# Altium project Smartwatch.PrjPcb (part 1 of 2)
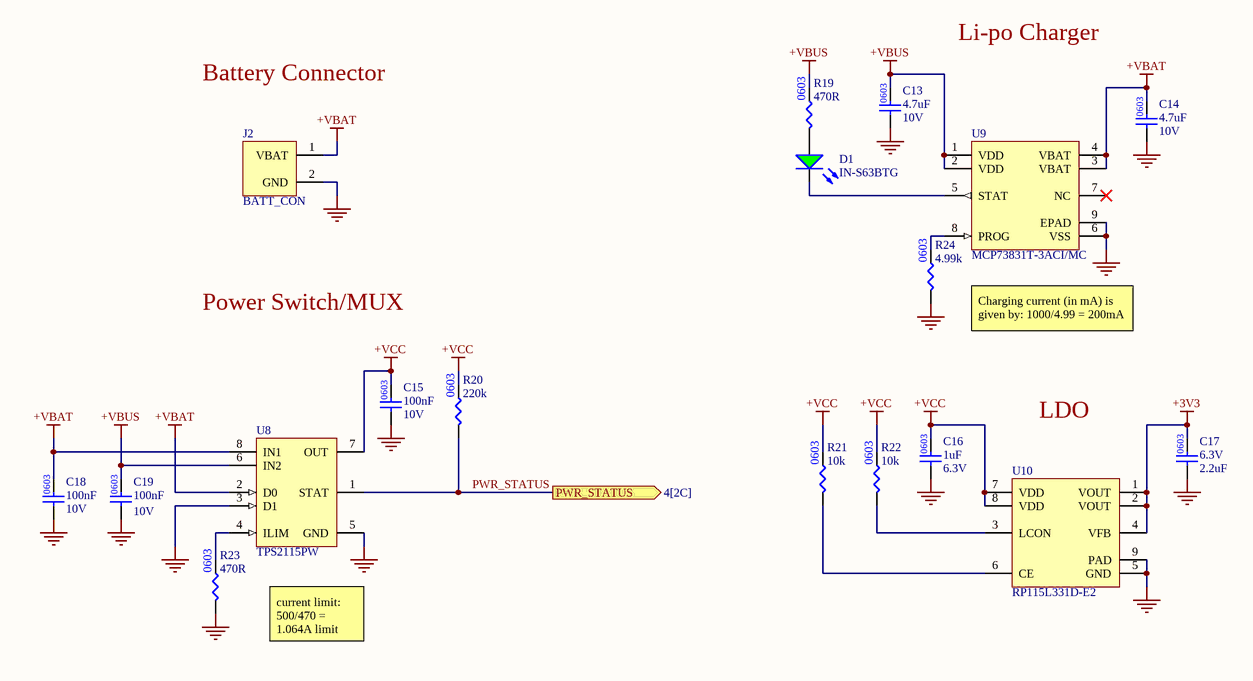
[diagram p0: Board_Power.SchDoc]
Revision: 1; Project_title: Smartwatch
4 sheets, 66 parts. Net scope: flat (ports and power ports of the same name join across sheets).
Board file: Smartwatch.PcbDoc
Sheets:
  Board_Power.SchDoc
  ESP32.SchDoc
  Sensors.SchDoc
  IO_Expander.SchDoc

## Sheet Board_Power.SchDoc: Board Power
size A4; Engineer: Jason Skells; SheetNumber: 1; SheetTotal: 4

### Parts
C13  Capacitance: 4.7uF  Voltage Rating: 10V  [CAP_0603]  (hidden comment: CL10A475KP8NNNC)
C14  Capacitance: 4.7uF  Voltage Rating: 10V  [CAP_0603]  (hidden comment: CL10A475KP8NNNC)
C15  Capacitance: 100nF  Voltage Rating: 10V  [CAP_0603]  (hidden comment: CC0603KRX7R6BB104)
C16  Capacitance: 1uF  Voltage Rating (DC): 6.3V  [CAP_0603]  (hidden comment: CL10A105KQ8NNNC)
C17  Voltage Rating: 6.3V  Capacitance: 2.2uF  [CAP_0603]  (hidden comment: CL10A225KQ8NNNC)
C18  Capacitance: 100nF  Voltage Rating: 10V  [CAP_0603]  (hidden comment: CC0603KRX7R6BB104)
C19  Capacitance: 100nF  Voltage Rating: 10V  [CAP_0603]  (hidden comment: CC0603KRX7R6BB104)
D1  IN-S63BTG  [LED_0603]
J2  BATT_CON  [BATT_CON]
R19  Resistance: 470R  [RES_0603]  (hidden comment: RC0603FR-07470RL)
R20  Resistance: 220k  [RES_0603]  (hidden comment: RMCF0603FT220K)
R21  Resistance: 10k  [RES_0603]  (hidden comment: RNCP0603FTD10K0)
R22  Resistance: 10k  [RES_0603]  (hidden comment: RNCP0603FTD10K0)
R23  Resistance: 470R  [RES_0603]  (hidden comment: RC0603FR-07470RL)
R24  Resistance: 4.99k  [RES_0603]  (hidden comment: RC0603FR-074K99L)
U8  TPS2115PW  [TPS2115PW]
U9  MCP73831T-3ACI/MC  [MCP73831T-3ACI/MC]
U10  RP115L331D-E2  [RP115L331D-E2]

### Ports
PWR_STATUS (out, see 4[2C])

### Nets
+3V3: C17.2 U10.1(VOUT) U10.2(VOUT) U10.4(VFB)
+VBAT: C14.2 C18.2 J2.1(VBAT) U8.2(D0) U8.8(IN1) U9.3(VBAT) U9.4(VBAT)
+VBUS: C13.2 C19.2 R19.2 U8.6(IN2) U9.1(VDD) U9.2(VDD)
+VCC: C15.2 C16.2 R20.2 R21.2 R22.2 U8.7(OUT) U10.7(VDD) U10.8(VDD)
GND: C13.1 C14.1 C15.1 C16.1 C17.1 C18.1 C19.1 J2.2(GND) R23.1 R24.1 U8.3(D1) U8.5(GND) U9.6(VSS) U9.9(EPAD) U10.5(GND) U10.9(PAD)
PWR_STATUS: R20.1 U8.1(STAT) ; port PWR_STATUS
NetD1_1: D1.1(A) R19.1
NetD1_2: D1.2(K) U9.5(STAT)
NetR21_1: R21.1 U10.6(CE)
NetR22_1: R22.1 U10.3(LCON)
NetR23_2: R23.2 U8.4(ILIM)
NetR24_2: R24.2 U9.8(PROG)

Not connected (* = marked no-connect by the designer): U9 7(NC)*

### Notes on the sheet
- Li-po Charger
- Battery Connector
- Power Switch/MUX
- Charging current (in mA) is given by: 1000/4.99 = 200mA
- LDO
- current limit: 500/470 = 1.064A limit

### Library data of the parts
C13 C14 = CL10A475KP8NNNC: CAP CER 4.7UF 10V X5R 0603; Manufacturer: Samsung; Tolerance: 10%; Supplier 1: Digi-Key; Manufacturer Part Number: CL10A475KP8NNNC; RoHS: Yes; Category: Ceramic Capacitors; Stock 1: 5193189; Pricing 1: 1=0.10000, 10=0.04700, 50=0.02580, 100=0.02110, 500=0.01506, 1000=0.01183 (USD); Mount: Surface Mount; Case/Package: 0603; Case Code (Metric): 1608; Case Code (Imperial): 0603; Contact Plating: Tin; Min Operating Temperature: -55°C; Max Operating Temperature: 85°C; Package Quantity: 1; Packaging: Tape and Reel; Dielectric: X5R; Series: CL; Construction: Flat; Length: 1.6mm; Width: 0.031inch; Height: 0.8mm; Thickness: 0.035inch; Depth: 0.8mm; Radiation Hardening: No; RoHS Compliant: Yes; ComponentLink1URL: https://datasheet.ciiva.com/25797/cl10a475kp8nnnc-25797520.pdf?src-supplier=Digi-Key; ComponentLink1Description: https://datasheet.ciiva.com/25797/cl10a475kp8nnnc-25797520.pdf?src-supplier=Digi-Key; ComponentLink2URL: https://datasheet.ciiva.com/26838/getdatasheetpartid-358676-26838384.pdf?src-supplier=Verical; ComponentLink2Description: https://datasheet.ciiva.com/26838/getdatasheetpartid-358676-26838384.pdf?src-supplier=Verical; ComponentLink3URL: https://datasheet.ciiva.com/16318/cl05b104kq5nnnc-16318245.pdf?src-supplier=Future+Electronics; ComponentLink3Description: https://datasheet.ciiva.com/16318/cl05b104kq5nnnc-16318245.pdf?src-supplier=Future+Electronics; Supplier Part Number 1: 1276-1044-1-ND
C15 C18 C19 = CC0603KRX7R6BB104: CAP CER 0.1UF 10V X7R 0603; Manufacturer: Yageo; Tolerance: 10%; Supplier 1: Digi-Key; Manufacturer Part Number: CC0603KRX7R6BB104; RoHS: Yes; Category: Ceramic Capacitors; Stock 1: 135167; Pricing 1: 1=0.11000, 10=0.07700, 50=0.04340, 100=0.03600, 500=0.02522, 1000=0.02089 (USD); Mount: Surface Mount; Case/Package: 0603; Case Code (Imperial): 0603; Case Code (Metric): 1608; Weight: 7.1E-05oz; Min Operating Temperature: -55°C; Max Operating Temperature: 125°C; Dielectric: X7R; Voltage Rating (DC): 10V; Packaging: Tape and Reel; Termination: SMD/SMT; Resistor Type: Ceramic; Series: CC; Construction: Flat; Length: 1.6mm; Width: 0.8mm; Height: 0.8mm; Thickness: 0.035inch; Depth: 0.8mm; Radiation Hardening: No; Lead Free: Lead Free; Halogen Free: Halogen Free; RoHS Compliant: Yes; ComponentLink1URL: https://datasheet.ciiva.com/11586/upy-gphc-x7r-6-3v-to-50v-8-11586327.pdf?src-supplier=Avnet; ComponentLink1Description: https://datasheet.ciiva.com/11586/upy-gphc-x7r-6-3v-to-50v-8-11586327.pdf?src-supplier=Avnet; Supplier Part Number 1: 311-4055-1-ND
C16 = CL10A105KQ8NNNC: CAP CER 1UF 6.3V X5R 0603; Manufacturer: Samsung; Tolerance: 10%; Supplier 1: Digi-Key; Manufacturer Part Number: CL10A105KQ8NNNC; RoHS: Yes; Category: Ceramic Capacitors; Stock 1: 1150582; Pricing 1: 1=0.10000, 10=0.03100, 50=0.01700, 100=0.01390, 500=0.00990, 1000=0.00777 (USD); Mount: Surface Mount; Case/Package: 0603; Case Code (Metric): 1608; Case Code (Imperial): 0603; Min Operating Temperature: -55°C; Max Operating Temperature: 85°C; Dielectric: X5R; Packaging: Tape and Reel; Package Quantity: 1; Voltage Rating: 6.3V; Series: CL; Construction: Flat; Length: 1.6mm; Width: 0.031inch; Height: 0.8mm; Thickness: 0.035inch; Depth: 0.8mm; Radiation Hardening: No; Lead Free: Lead Free; RoHS Compliant: Yes; ComponentLink1URL: https://datasheet.ciiva.com/25801/cl10a105kq8nnnc-25801975.pdf?src-supplier=Digi-Key; ComponentLink1Description: https://datasheet.ciiva.com/25801/cl10a105kq8nnnc-25801975.pdf?src-supplier=Digi-Key; ComponentLink2URL: https://datasheet.ciiva.com/26838/getdatasheetpartid-355285-26838337.pdf?src-supplier=Verical; ComponentLink2Description: https://datasheet.ciiva.com/26838/getdatasheetpartid-355285-26838337.pdf?src-supplier=Verical; ComponentLink3URL: https://datasheet.ciiva.com/16199/cl10a105ko8nnnc-16199274.pdf?src-supplier=Future+Electronics; ComponentLink3Description: https://datasheet.ciiva.com/16199/cl10a105ko8nnnc-16199274.pdf?src-supplier=Future+Electronics; Supplier Part Number 1: 1276-1036-1-ND
C17 = CL10A225KQ8NNNC: CAP CER 2.2UF 6.3V X5R 0603; Manufacturer: Samsung; Tolerance: 10%; Supplier 1: Digi-Key; Manufacturer Part Number: CL10A225KQ8NNNC; RoHS: Yes; Category: Ceramic Capacitors; Stock 1: 697049; Pricing 1: 1=0.10000, 10=0.04200, 50=0.02300, 100=0.01870, 500=0.01336, 1000=0.01050 (USD); Mount: Surface Mount; Case/Package: 0603; Case Code (Metric): 1608; Case Code (Imperial): 0603; Contact Plating: Tin; Min Operating Temperature: -55°C; Max Operating Temperature: 85°C; Packaging: Tape and Reel; Package Quantity: 1; Dielectric: X5R; Voltage Rating (DC): 6.3V; Series: CL; Construction: Flat; Voltage: 6.3V; Length: 1.6mm; Width: 0.031inch; Height: 0.8mm; Thickness: 0.035inch; Depth: 0.8mm; Radiation Hardening: No; Lead Free: Lead Free; RoHS Compliant: Yes; ComponentLink1URL: https://datasheet.ciiva.com/16199/cl10a225kq8nnnc-16199203.pdf?src-supplier=Future+Electronics; ComponentLink1Description: https://datasheet.ciiva.com/16199/cl10a225kq8nnnc-16199203.pdf?src-supplier=Future+Electronics; ComponentLink2URL: https://datasheet.ciiva.com/15195/getdatasheetpartid-358618-15195712.pdf?src-supplier=Verical; ComponentLink2Description: https://datasheet.ciiva.com/15195/getdatasheetpartid-358618-15195712.pdf?src-supplier=Verical; Supplier Part Number 1: 1276-1183-1-ND
D1 = IN-S63BTG: LED Uni-Color Green 530nm 2-Pin Chip 0603(1608Metric) T/R; Manufacturer: Inolux; Supplier 1: Digi-Key; Manufacturer Part Number: IN-S63BTG; RoHS: Yes; Category: LEDs; Stock 1: 10550; Pricing 1: 1=0.33000, 10=0.26300, 100=0.11830, 500=0.10684, 1000=0.08777, 2000=0.07632 (USD); Supplier Part Number 1: 1830-1069-1-ND
J2 = BATT_CON: Pads for Battery Connection
R19 R23 = RC0603FR-07470RL: RES 470 OHM 1% 1/10W 0603; Manufacturer: Yageo; Power Rating: 100mW; Voltage Rating: 50V; Temperature Coefficient: 100ppm/°C; Working Voltage: 75V; Supplier 1: Digi-Key; Manufacturer Part Number: RC0603FR-07470RL; RoHS: Yes; Category: Chip SMD Resistors; Stock 1: 1312688; Pricing 1: 1=0.10000, 10=0.02400, 100=0.00970, 1000=0.00436, 2500=0.00378 (USD); Case/Package: 0603; Case Code (Metric): 1608; Case Code (Imperial): 0603; Min Operating Temperature: -55°C; Max Operating Temperature: 155°C; Tolerance: 1%; Packaging: Tape and Reel; Package Quantity: 1; Resistor Type: Thick Film; Number of Terminations: 2; Termination: SMD/SMT; Max Power Dissipation: 100mW; Features: Moisture Resistant; Series: RC; Technology: THICK FILM; Resistance Tolerance: 1%; Construction: Rectangular; Length: 1.6mm; Width: 0.031inch; Height: 0.022inch; Depth: 0.8mm; RoHS Compliant: Yes; REACH SVHC: No SVHC; Military Standard: Not; Lead Free: Lead Free; ComponentLink1URL: https://datasheet.ciiva.com/11808/0900766b80f96399-11808177.pdf?src-supplier=RSComponents; ComponentLink1Description: https://datasheet.ciiva.com/11808/0900766b80f96399-11808177.pdf?src-supplier=RSComponents; ComponentLink2URL: https://datasheet.ciiva.com/7660/1868787-7660793.pdf?src-supplier=Element14; ComponentLink2Description: https://datasheet.ciiva.com/7660/1868787-7660793.pdf?src-supplier=Element14; ComponentLink3URL: https://datasheet.ciiva.com/46440/1868787-46440907.pdf?src-supplier=Element14; ComponentLink3Description: https://datasheet.ciiva.com/46440/1868787-46440907.pdf?src-supplier=Element14; ComponentLink4URL: https://datasheet.ciiva.com/2454/pyu-r-int-thick-7-2454013.pdf?src-supplier=Digi-Key; ComponentLink4Description: https://datasheet.ciiva.com/2454/pyu-r-int-thick-7-2454013.pdf?src-supplier=Digi-Key; ComponentLink5URL: https://datasheet.ciiva.com/2454/pyu-r-int-thick-7-2454014.pdf?src-supplier=Digi-Key; ComponentLink5Description: https://datasheet.ciiva.com/2454/pyu-r-int-thick-7-2454014.pdf?src-supplier=Digi-Key; ComponentLink6URL: https://datasheet.ciiva.com/2454/pyu-r-int-thick-7-2454012.pdf?src-supplier=Digi-Key; ComponentLink6Description: https://datasheet.ciiva.com/2454/pyu-r-int-thick-7-2454012.pdf?src-supplier=Digi-Key; ComponentLink7URL: https://datasheet.ciiva.com/7746/1738695-7746359.pdf?src-supplier=Element14; ComponentLink7Description: https://datasheet.ciiva.com/7746/1738695-7746359.pdf?src-supplier=Element14; ComponentLink8URL: https://datasheet.ciiva.com/7746/1738695-7746360.pdf?src-supplier=Element14; ComponentLink8Description: https://datasheet.ciiva.com/7746/1738695-7746360.pdf?src-supplier=Element14; Supplier Part Number 1: 311-470HRCT-ND
R20 = RMCF0603FT220K: Res Thick Film 0603 220K Ohm 1% 0.1W(1/10W) ±100ppm/C Pad SMD Automotive T/R; Manufacturer: Stackpole Electronics; Max Power Dissipation: 100mW; Temperature Coefficient: 100ppm/°C; Supplier 1: Digi-Key; Manufacturer Part Number: RMCF0603FT220K; RoHS: Yes; Category: Chip SMD Resistors; Stock 1: 3017881; Pricing 1: 1=0.10000, 10=0.01700, 100=0.00680, 1000=0.00305, 2500=0.00264 (USD); Mount: Surface Mount; Case/Package: 0603; Case Code (Metric): 1608; Case Code (Imperial): 0603; Contact Plating: Tin,Matte; Min Operating Temperature: -55°C; Max Operating Temperature: 155°C; Tolerance: 1%; Packaging: Tape and Reel; Resistor Type: Thick Film; Number of Terminations: 2; Features: Automotive AEC-Q200; Series: RMCF; Construction: Rectangular; Length: 0.061inch; Width: 0.031inch; Height: 0.022inch; Depth: 0.8mm; Radiation Hardening: No; Military Standard: Not; Lead Free: Lead Free; RoHS Compliant: Yes; ComponentLink1URL: https://datasheet.ciiva.com/26835/getdatasheetpartid-479010-26835622.pdf?src-supplier=Verical; ComponentLink1Description: https://datasheet.ciiva.com/26835/getdatasheetpartid-479010-26835622.pdf?src-supplier=Verical; Supplier Part Number 1: RMCF0603FT220KCT-ND
R21 R22 = RNCP0603FTD10K0: Res Thin Film 0603 10K Ohm 1% 1/8W ±100ppm/°C Molded SMD SMD Paper T/R; Manufacturer: Stackpole Electronics; Max Power Dissipation: 125mW; Supplier 1: Digi-Key; Manufacturer Part Number: RNCP0603FTD10K0; RoHS: Yes; Category: Chip SMD Resistors; Stock 1: 2737524; Pricing 1: 1=0.10000, 10=0.06100, 100=0.02480, 1000=0.01113, 2500=0.00966 (USD); Mount: Surface Mount; Case/Package: 0603; Case Code (Metric): 1608; Case Code (Imperial): 0603; Contact Plating: Tin,Matte; Min Operating Temperature: -55°C; Max Operating Temperature: 155°C; Packaging: Tape and Reel; Tolerance: 1%; Resistor Type: Thin Film; Number of Terminations: 2; Temperature Coefficient: 100ppm/°C; Features: Moisture Resistant,Anti-Sulfur; Series: RNCP; Length: 0.059inch; Width: 0.031inch; Height: 0.02inch; Radiation Hardening: No; Lead Free: Lead Free; RoHS Compliant: Yes; ComponentLink1URL: https://www.seielect.com/Catalog/SEI-rncp.pdf?src-supplier=Avnet; ComponentLink1Description: https://www.seielect.com/Catalog/SEI-rncp.pdf?src-supplier=Avnet; ComponentLink2URL: https://www.seielect.com/Catalog/SEI-rncp.pdf?src-supplier=Digi-Key; ComponentLink2Description: https://www.seielect.com/Catalog/SEI-rncp.pdf?src-supplier=Digi-Key; ComponentLink3URL: https://www.seielect.com/catalog/SEI-Packaging.pdf?src-supplier=Digi-Key; ComponentLink3Description: https://www.seielect.com/catalog/SEI-Packaging.pdf?src-supplier=Digi-Key; Supplier Part Number 1: RNCP0603FTD10K0CT-ND
R24 = RC0603FR-074K99L: RES 4.99K OHM 1% 1/10W 0603; Manufacturer: Yageo; Voltage Rating: 75V; Power Rating: 100mW; Temperature Coefficient: 100ppm/°C; Voltage Rating (DC): 50V; Supplier 1: Digi-Key; Manufacturer Part Number: RC0603FR-074K99L; RoHS: Yes; Category: Chip SMD Resistors; Stock 1: 5200913; Pricing 1: 1=0.10000, 10=0.02400, 100=0.00970, 1000=0.00436, 2500=0.00378 (USD); Case/Package: 0603; Number of Pins: 2; Case Code (Imperial): 0603; Case Code (Metric): 1608; Weight: 7.1E-05oz; Size Code: 0603; Min Operating Temperature: -55°C; Max Operating Temperature: 155°C; Packaging: Tape and Reel; Tolerance: 1%; Package Quantity: 1; Termination: SMD/SMT; Resistor Type: Thick Film; Number of Terminations: 2; Max Power Dissipation: 100mW; Features: Moisture Resistant; Series: RC; Construction: Rectangular; Resistance Tolerance: 1%; Length: 1.6mm; Width: 0.8mm; Height: 0.022inch; Depth: 0.8mm; REACH SVHC: Unknown; Military Standard: Not; Lead Free: Lead Free; RoHS Compliant: Yes; ComponentLink1URL: https://datasheet.ciiva.com/7983/443971-7983646.pdf?src-supplier=Element14; ComponentLink1Description: https://datasheet.ciiva.com/7983/443971-7983646.pdf?src-supplier=Element14; ComponentLink2URL: https://datasheet.ciiva.com/22747/443971-22747529.pdf?src-supplier=Element14; ComponentLink2Description: https://datasheet.ciiva.com/22747/443971-22747529.pdf?src-supplier=Element14; ComponentLink3URL: https://datasheet.ciiva.com/2453/pyu-r-int-thick-7-2453980.pdf?src-supplier=Digi-Key; ComponentLink3Description: https://datasheet.ciiva.com/2453/pyu-r-int-thick-7-2453980.pdf?src-supplier=Digi-Key; ComponentLink4URL: https://datasheet.ciiva.com/2453/pyu-r-int-thick-7-2453981.pdf?src-supplier=Digi-Key; ComponentLink4Description: https://datasheet.ciiva.com/2453/pyu-r-int-thick-7-2453981.pdf?src-supplier=Digi-Key; ComponentLink5URL: https://datasheet.ciiva.com/2453/pyu-r-int-thick-7-2453979.pdf?src-supplier=Digi-Key; ComponentLink5Description: https://datasheet.ciiva.com/2453/pyu-r-int-thick-7-2453979.pdf?src-supplier=Digi-Key; Supplier Part Number 1: 311-4.99KHRCT-ND
U8 = TPS2115PW: Pwr Mux Autoswitch 1.5V to 5.5V 1.25A 8-Pin TSSOP Tube; Manufacturer: Texas Instruments; Number of Outputs: 1; Number of Inputs: 2; Min Input Voltage: 2.8V; Turn-On Delay Time: 1ms; Max Power Dissipation: 386.84mW; On-State Resistance: 84mR; Max Supply Current: 55uA; Output Voltage: 6V; Supplier 1: Digi-Key; Manufacturer Part Number: TPS2115PW; RoHS: Yes; Category: Voltage Regulators - Switching; Stock 1: 1098; Pricing 1: 1=2.94000, 10=2.63600, 25=2.49240, 100=2.16000, 250=2.04924, 500=1.83878, 1000=1.82875 (USD); Case/Package: TSSOP; Number of Pins: 8; Weight: 0.001376oz; Min Operating Temperature: -40°C; Max Operating Temperature: 85°C; Output Current: 1.25A; Packaging: Rail/Tube; Package Quantity: 150; Max Output Current: 1.25A; Max Input Voltage: 5.5V; Current - Output 2: 1.25A; Operating Supply Voltage: 5.5V; Series: -; Length: 3mm; Width: 4.4mm; Height: 1.15mm; Radiation Hardening: No; Lead Free: Lead Free; RoHS Compliant: Yes; REACH SVHC: No SVHC; ComponentLink1URL: https://datasheet.ciiva.com/1960/tps2114-1960868.pdf?src-supplier=Digi-Key; ComponentLink1Description: https://datasheet.ciiva.com/1960/tps2114-1960868.pdf?src-supplier=Digi-Key; ComponentLink2URL: https://datasheet.ciiva.com/4923/slvs447a-206199-4923489.pdf?src-supplier=Mouser; ComponentLink2Description: https://datasheet.ciiva.com/4923/slvs447a-206199-4923489.pdf?src-supplier=Mouser; ComponentLink3URL: https://datasheet.ciiva.com/3232/tps2115-3232474.pdf?src-supplier=Avnet; ComponentLink3Description: https://datasheet.ciiva.com/3232/tps2115-3232474.pdf?src-supplier=Avnet; Supplier Part Number 1: 296-14207-5-ND
U9 = MCP73831T-3ACI/MC: Battery Management - Advanced Lithium-Ion/-Polymer Charge mgnt contr; Manufacturer: Microchip; Output Voltage: 4.35V; Output Current: 500mA; Min Supply Voltage: 3.75V; Max Supply Voltage: 6V; Supplier 1: Digi-Key; Manufacturer Part Number: MCP73831T-3ACI/MC; RoHS: Yes; Category: Battery Management; Stock 1: 1670; Pricing 1: 1=0.83000, 25=0.69960, 100=0.64500 (USD); Mount: Surface Mount; Case/Package: DFN; Number of Pins: 8; Min Operating Temperature: -40°C; Max Operating Temperature: 85°C; Packaging: Tape and Reel; Package Quantity: 3300; Radiation Hardening: No; Lead Free: Lead Free; RoHS Compliant: Yes; ComponentLink1URL: https://datasheet.ciiva.com/3215/21984e-3215301.pdf?src-supplier=Avnet; ComponentLink1Description: https://datasheet.ciiva.com/3215/21984e-3215301.pdf?src-supplier=Avnet; ComponentLink2URL: https://datasheet.ciiva.com/1933/21984e-1933408.pdf?src-supplier=Digi-Key; ComponentLink2Description: https://datasheet.ciiva.com/1933/21984e-1933408.pdf?src-supplier=Digi-Key; Supplier Part Number 1: MCP73831T-3ACI/MCCT-ND
U10 = RP115L331D-E2: LDO Regulator Pos 3.3V 0.5A/1A 8-Pin DFN EP T/R; Manufacturer: Ricoh; Supplier 1: Digi-Key; Manufacturer Part Number: RP115L331D-E2; RoHS: No; Category: Voltage Regulators - Linear; Supplier Part Number 1: 2129-RP115L331D-E2CT-ND

## Sheet ESP32.SchDoc: MCU & Display
size A4; Engineer: Jason Skells; SheetNumber: 2; SheetTotal: 4
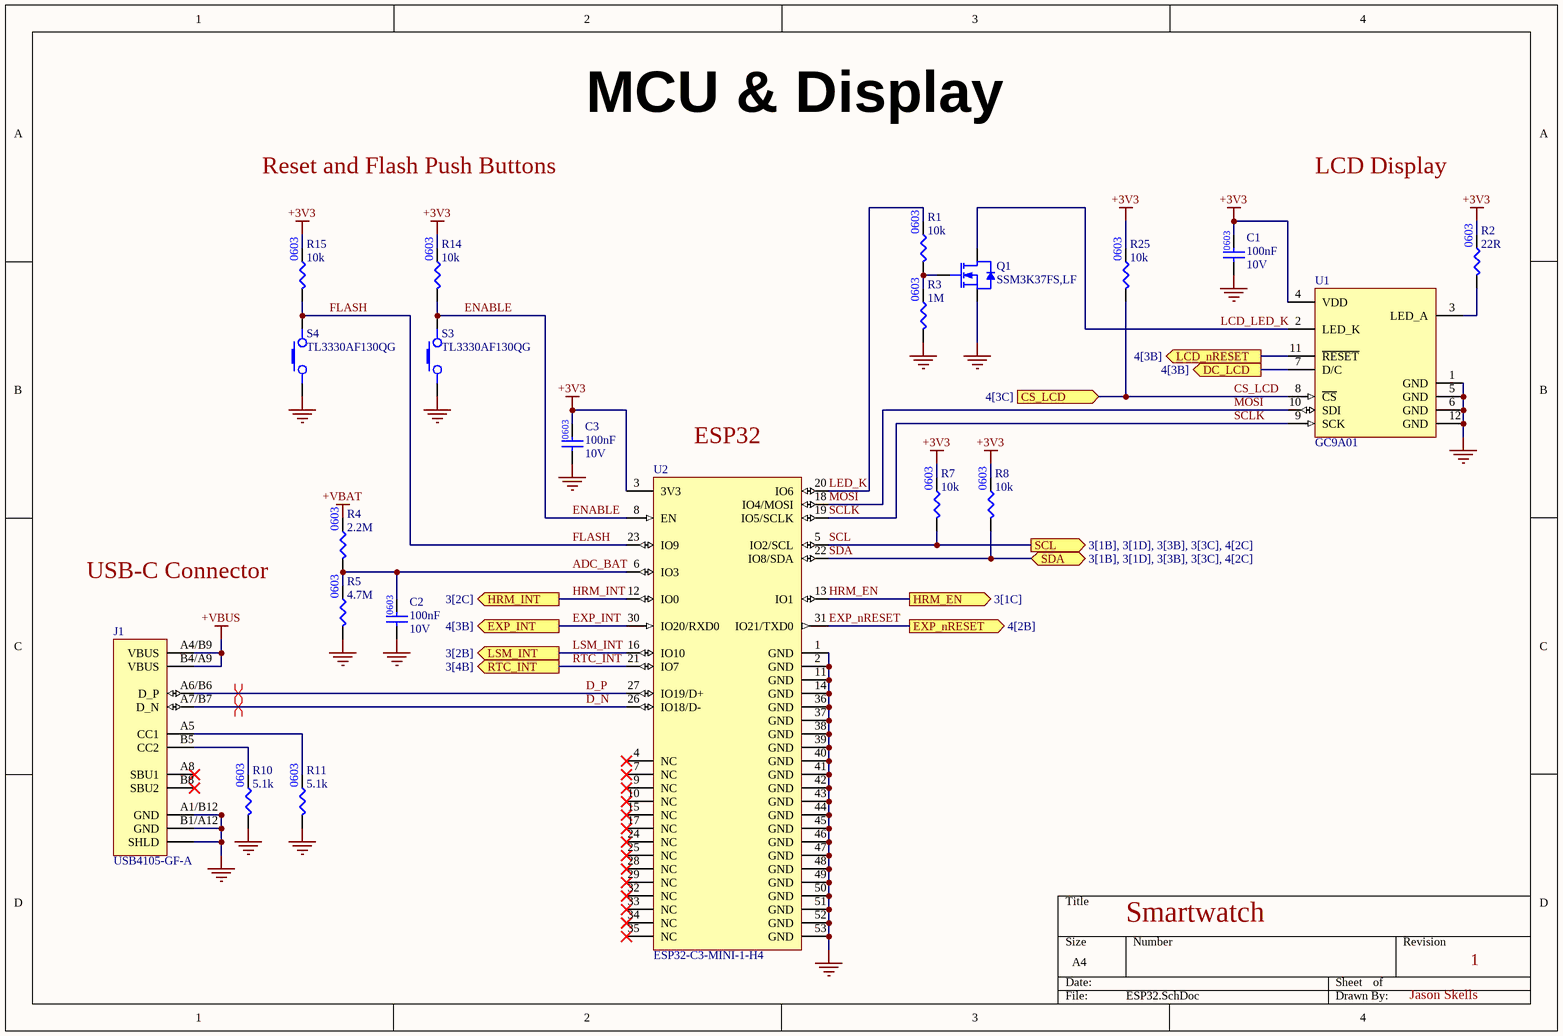
[diagram p1: ESP32.SchDoc]

### Parts
C1  Capacitance: 100nF  Voltage Rating: 10V  [CAP_0603]  (hidden comment: CC0603KRX7R6BB104)
C2  Capacitance: 100nF  Voltage Rating: 10V  [CAP_0603]  (hidden comment: CC0603KRX7R6BB104)
C3  Capacitance: 100nF  Voltage Rating: 10V  [CAP_0603]  (hidden comment: CC0603KRX7R6BB104)
J1  USB4105-GF-A  [USB4105-GF-A]
Q1  SSM3K37FS,LF  [SSM3K37FS,LF]
R1  Resistance: 10k  [RES_0603]  (hidden comment: RNCP0603FTD10K0)
R2  Resistance: 22R  [RES_0603]  (hidden comment: RC0603FR-0722RL)
R3  Resistance: 1M  [RES_0603]  (hidden comment: RC0603FR-071ML)
R4  Resistance: 2.2M  [RES_0603]  (hidden comment: RC0603FR-072M2L)
R5  Resistance: 4.7M  [RES_0603]  (hidden comment: RC0603FR-074M7L)
R7  Resistance: 10k  [RES_0603]  (hidden comment: RNCP0603FTD10K0)
R8  Resistance: 10k  [RES_0603]  (hidden comment: RNCP0603FTD10K0)
R10  Resistance: 5.1k  [RES_0603]  (hidden comment: RMCF0603FT5K10)
R11  Resistance: 5.1k  [RES_0603]  (hidden comment: RMCF0603FT5K10)
R14  Resistance: 10k  [RES_0603]  (hidden comment: RNCP0603FTD10K0)
R15  Resistance: 10k  [RES_0603]  (hidden comment: RNCP0603FTD10K0)
R25  Resistance: 10k  [RES_0603]  (hidden comment: RNCP0603FTD10K0)
S3  TL3330AF130QG  [TL3330AF130QG]
S4  TL3330AF130QG  [TL3330AF130QG]
U1  GC9A01  [GC9A01]
U2  ESP32-C3-MINI-1-H4  [ESP32-C3-MINI-1-H4]

### Ports
CS_LCD (in, see 4[3C]), DC_LCD (out, see 4[3B]), EXP_INT (out, see 4[3B]), EXP_nRESET (out, see 4[2B]), HRM_EN (out, see 3[1C]), HRM_INT (out, see 3[2C]), LCD_nRESET (out, see 4[3B]), LSM_INT (out, see 3[2B]), RTC_INT (out, see 3[4B]), SCL (out, see 3[1B], 3[1D], 3[3B], 3[3C], 4[2C]), SDA (bidir, see 3[1B], 3[1D], 3[3B], 3[3C], 4[2C])

### Nets
+3V3: C1.2 C3.2 R2.2 R7.2 R8.2 R14.2 R15.2 R25.2 U1.4(VDD) U2.3(3V3)
+VBAT: R4.2
+VBUS: J1.A4/B9(VBUS) J1.B4/A9(VBUS)
GND: C1.1 C2.1 C3.1 J1.A1/B12(GND) J1.B1/A12(GND) J1.SHLD Q1.3(Source) R3.1 R5.1 R10.1 R11.1 S3.2 S4.2 U1.1(GND) U1.5(GND) U1.6(GND) U1.12(GND) U2.1(GND) U2.2(GND) U2.11(GND) U2.14(GND) U2.36(GND) U2.37(GND) U2.38(GND) U2.39(GND) U2.40(GND) U2.41(GND) U2.42(GND) U2.43(GND) U2.44(GND) U2.45(GND) U2.46(GND) U2.47(GND) U2.48(GND) U2.49(GND) U2.50(GND) U2.51(GND) U2.52(GND) U2.53(GND)
ADC_BAT: C2.2 R4.1 R5.2 U2.6(IO3)
CS_LCD: R25.1 U1.8(~{CS}) ; port CS_LCD
D_N: J1.A7/B7(D_N) U2.26(IO18/D-)
D_P: J1.A6/B6(D_P) U2.27(IO19/D+)
DC_LCD: U1.7(D/C) ; port DC_LCD
ENABLE: R14.1 S3.1 U2.8(EN)
EXP_INT: U2.30(IO20/RXD0) ; port EXP_INT
EXP_nRESET: U2.31(IO21/TXD0) ; port EXP_nRESET
FLASH: R15.1 S4.1 U2.23(IO9)
HRM_EN: U2.13(IO1) ; port HRM_EN
HRM_INT: U2.12(IO0) ; port HRM_INT
LCD_LED_K: Q1.1(Drain) U1.2(LED_K)
LCD_nRESET: U1.11(~{RESET}) ; port LCD_nRESET
LED_K: R1.2 U2.20(IO6)
LSM_INT: U2.16(IO10) ; port LSM_INT
MOSI: U1.10(SDI) U2.18(IO4/MOSI)
RTC_INT: U2.21(IO7) ; port RTC_INT
SCL: R7.1 U2.5(IO2/SCL) ; port SCL
SCLK: U1.9(SCK) U2.19(IO5/SCLK)
SDA: R8.1 U2.22(IO8/SDA) ; port SDA
NetJ1_A5: J1.A5(CC1) R11.2
NetJ1_B5: J1.B5(CC2) R10.2
NetQ1_2: Q1.2(Gate) R1.1 R3.2
NetR2_1: R2.1 U1.3(LED_A)

Not connected (* = marked no-connect by the designer): J1 A8(SBU1)* B8(SBU2)*; U2 4(NC)* 7(NC)* 9(NC)* 10(NC)* 15(NC)* 17(NC)* 24(NC)* 25(NC)* 28(NC)* 29(NC)* 32(NC)* 33(NC)* 34(NC)* 35(NC)*

### Layout directives
differential pair: D_N, D_P

### Notes on the sheet
- Reset and Flash Push Buttons
- LCD Display
- (near U2) ESP32
- USB-C Connector

### Library data of the parts
C1-C3 = CC0603KRX7R6BB104: as C15 on sheet Board_Power; Supplier 1: Digi-Key; Manufacturer Part Number: CC0603KRX7R6BB104; RoHS: Yes; Category: Ceramic Capacitors; Stock 1: 135167; Pricing 1: 1=0.11000, 10=0.07700, 50=0.04340, 100=0.03600, 500=0.02522, 1000=0.02089 (USD); Mount: Surface Mount; Case/Package: 0603; Case Code (Imperial): 0603; Case Code (Metric): 1608; Weight: 7.1E-05oz; Min Operating Temperature: -55°C; Max Operating Temperature: 125°C; Dielectric: X7R; Voltage Rating (DC): 10V; Packaging: Tape and Reel; Termination: SMD/SMT; Resistor Type: Ceramic; Series: CC; Construction: Flat; Length: 1.6mm; Width: 0.8mm; Height: 0.8mm; Thickness: 0.035inch; Depth: 0.8mm; Radiation Hardening: No; Lead Free: Lead Free; Halogen Free: Halogen Free; RoHS Compliant: Yes; ComponentLink1URL: https://datasheet.ciiva.com/11586/upy-gphc-x7r-6-3v-to-50v-8-11586327.pdf?src-supplier=Avnet; ComponentLink1Description: https://datasheet.ciiva.com/11586/upy-gphc-x7r-6-3v-to-50v-8-11586327.pdf?src-supplier=Avnet; Supplier Part Number 1: 311-4055-1-ND
J1 = USB4105-GF-A: Conn USB 2.0 Type C RCP 24 POS 0.3mm/0.5mm Solder RA SMD 24 Terminal 1 Port T/R; Manufacturer: Global Connector Technology; Supplier 1: Digi-Key; Manufacturer Part Number: USB4105-GF-A; RoHS: No; Category: USB Connectors; Supplier Part Number 1: 2073-USB4105-GF-ACT-ND
Q1 = SSM3K37FS,LF: MOSFET NCH 20V 200MA SSM; Manufacturer: Toshiba; Rds On Max: 2.2R; Input Capacitance: 12pF; Max Power Dissipation: 100mW; Supplier 1: Digi-Key; RoHS: Yes; Category: MOSFETs; Stock 1: 73760; Pricing 1: 1=0.25000, 10=0.20100, 100=0.10660, 500=0.07012, 1000=0.04768 (USD); Mount: Surface Mount; Packaging: Tape and Reel; Drain to Source Voltage (Vdss): 20V; Continuous Drain Current (ID): 200mA; ComponentLink1URL: https://toshiba.semicon-storage.com/info/docget.jsp?did=6172&prodName=SSM3K37FS&src-supplier=Digi-Key; ComponentLink1Description: https://toshiba.semicon-storage.com/info/docget.jsp?did=6172&prodName=SSM3K37FS&src-supplier=Digi-Key; Supplier Part Number 1: SSM3K37FSLFCT-ND; Manufacturer Part Number: SSM3K37FS,LF
R1 R7 R8 R14 R15 R25 = RNCP0603FTD10K0: as R21 on sheet Board_Power; Supplier 1: Digi-Key; Manufacturer Part Number: RNCP0603FTD10K0; RoHS: Yes; Category: Chip SMD Resistors; Stock 1: 2737524; Pricing 1: 1=0.10000, 10=0.06100, 100=0.02480, 1000=0.01113, 2500=0.00966 (USD); Mount: Surface Mount; Case/Package: 0603; Case Code (Metric): 1608; Case Code (Imperial): 0603; Contact Plating: Tin,Matte; Min Operating Temperature: -55°C; Max Operating Temperature: 155°C; Packaging: Tape and Reel; Tolerance: 1%; Resistor Type: Thin Film; Number of Terminations: 2; Temperature Coefficient: 100ppm/°C; Features: Moisture Resistant,Anti-Sulfur; Series: RNCP; Length: 0.059inch; Width: 0.031inch; Height: 0.02inch; Radiation Hardening: No; Lead Free: Lead Free; RoHS Compliant: Yes; ComponentLink1URL: https://www.seielect.com/Catalog/SEI-rncp.pdf?src-supplier=Avnet; ComponentLink1Description: https://www.seielect.com/Catalog/SEI-rncp.pdf?src-supplier=Avnet; ComponentLink2URL: https://www.seielect.com/Catalog/SEI-rncp.pdf?src-supplier=Digi-Key; ComponentLink2Description: https://www.seielect.com/Catalog/SEI-rncp.pdf?src-supplier=Digi-Key; ComponentLink3URL: https://www.seielect.com/catalog/SEI-Packaging.pdf?src-supplier=Digi-Key; ComponentLink3Description: https://www.seielect.com/catalog/SEI-Packaging.pdf?src-supplier=Digi-Key; Supplier Part Number 1: RNCP0603FTD10K0CT-ND
R2 = RC0603FR-0722RL: RES 22 OHM 1% 1/10W 0603; Manufacturer: Yageo; Temperature Coefficient: 100ppm/°C; Voltage Rating (DC): 50V; Power Rating: 100mW; Supplier 1: RSComponents; Manufacturer Part Number: RC0603FR-0722RL; RoHS: Yes; Category: Chip SMD Resistors; Stock 1: 10000; Pricing 1: 5000=0.00300, 10000=0.00300, 15000=0.00300, 20000=0.00300 (GBP); Case/Package: 0603; Number of Pins: 2; Case Code (Metric): 1608; Case Code (Imperial): 0603; Size Code: 0603; Min Operating Temperature: -55°C; Max Operating Temperature: 155°C; Tolerance: 1%; Resistor Type: Thick Film; Packaging: Tape and Reel; Voltage Rating: 50V; Package Quantity: 1; Number of Terminations: 2; Termination: SMD/SMT; Max Power Dissipation: 100mW; Features: Moisture Resistant; Series: RC; Resistance Tolerance: 1%; Technology: THICK FILM; Construction: Rectangular; Length: 1.6mm; Width: 0.031inch; Height: 0.022inch; Depth: 0.8mm; REACH SVHC: No SVHC; Lead Free: Lead Free; Military Standard: Not; RoHS Compliant: Yes; ComponentLink1URL: https://datasheet.ciiva.com/11819/0900766b80f96399-11819285.pdf?src-supplier=RSComponents; ComponentLink1Description: https://datasheet.ciiva.com/11819/0900766b80f96399-11819285.pdf?src-supplier=RSComponents; ComponentLink2URL: https://datasheet.ciiva.com/46395/443971-46395032.pdf?src-supplier=Element14; ComponentLink2Description: https://datasheet.ciiva.com/46395/443971-46395032.pdf?src-supplier=Element14; ComponentLink3URL: https://datasheet.ciiva.com/46440/1868787-46440901.pdf?src-supplier=Element14; ComponentLink3Description: https://datasheet.ciiva.com/46440/1868787-46440901.pdf?src-supplier=Element14; ComponentLink4URL: https://datasheet.ciiva.com/2454/pyu-r-int-thick-7-2454355.pdf?src-supplier=Digi-Key; ComponentLink4Description: https://datasheet.ciiva.com/2454/pyu-r-int-thick-7-2454355.pdf?src-supplier=Digi-Key; ComponentLink5URL: https://datasheet.ciiva.com/2454/pyu-r-int-thick-7-2454356.pdf?src-supplier=Digi-Key; ComponentLink5Description: https://datasheet.ciiva.com/2454/pyu-r-int-thick-7-2454356.pdf?src-supplier=Digi-Key; ComponentLink6URL: https://datasheet.ciiva.com/2454/pyu-r-int-thick-7-2454354.pdf?src-supplier=Digi-Key; ComponentLink6Description: https://datasheet.ciiva.com/2454/pyu-r-int-thick-7-2454354.pdf?src-supplier=Digi-Key; Supplier Part Number 1: 1995503
R3 = RC0603FR-071ML: RES 1M OHM 1% 1/10W 0603; Manufacturer: Yageo; Voltage Rating: 75V; Voltage Rating (DC): 50V; Power Rating: 100mW; Temperature Coefficient: 100ppm/°C; Application(s): HIGH RELIABILITY; Supplier 1: Digi-Key; Manufacturer Part Number: RC0603FR-071ML; RoHS: Yes; Category: Chip SMD Resistors; Stock 1: 2335859; Pricing 1: 1=0.10000, 10=0.02400, 100=0.00970, 1000=0.00436, 2500=0.00378 (USD); Case/Package: 0603; Number of Pins: 2; Case Code (Imperial): 0603; Case Code (Metric): 1608; Weight: 0.000847oz; Min Operating Temperature: -55°C; Max Operating Temperature: 155°C; Tolerance: 1%; Packaging: Cut Tape; Package Quantity: 5000; Termination: SMD/SMT; Resistor Type: Thick Film; Type: General Purpose; Series: RC; Technology: THICK FILM; Length: 1.6mm; Width: 0.8mm; Height: 0.45mm; Depth: 0.8mm; RoHS Compliant: Yes; REACH SVHC: No SVHC; Military Standard: Not; Lead Free: Lead Free; ComponentLink1URL: https://datasheet.ciiva.com/11819/0900766b80f96399-11819295.pdf?src-supplier=RSComponents; ComponentLink1Description: https://datasheet.ciiva.com/11819/0900766b80f96399-11819295.pdf?src-supplier=RSComponents; ComponentLink2URL: https://datasheet.ciiva.com/7983/443971-7983614.pdf?src-supplier=Element14; ComponentLink2Description: https://datasheet.ciiva.com/7983/443971-7983614.pdf?src-supplier=Element14; ComponentLink3URL: https://datasheet.ciiva.com/12555/rc0603-272842-12555388.pdf?src-supplier=Mouser; ComponentLink3Description: https://datasheet.ciiva.com/12555/rc0603-272842-12555388.pdf?src-supplier=Mouser; Supplier Part Number 1: 311-1.00MHRCT-ND
R4 = RC0603FR-072M2L: RES SMD 2.2M OHM 1% 1/10W 0603; Manufacturer: Yageo; Voltage Rating (DC): 50V; Power Rating: 100mW; Temperature Coefficient: 100ppm/°C; Supplier 1: Digi-Key; Manufacturer Part Number: RC0603FR-072M2L; RoHS: Yes; Category: Chip SMD Resistors; Stock 1: 189008; Pricing 1: 1=0.10000, 10=0.02400, 100=0.00970, 1000=0.00436, 2500=0.00378 (USD); Case/Package: 0603; Number of Pins: 2; Case Code (Imperial): 0603; Case Code (Metric): 1608; Size Code: 0603; Min Operating Temperature: -55°C; Max Operating Temperature: 155°C; Packaging: Tape and Reel; Tolerance: 1%; Voltage Rating: 50V; Package Quantity: 5000; Resistor Type: Thick Film; Number of Terminations: 2; Termination: SMD/SMT; Max Power Dissipation: 100mW; Features: Moisture Resistant; Series: RC; Resistance Tolerance: 1%; Technology: THICK FILM; Length: 1.6mm; Width: 0.8mm; Height: 0.45mm; Depth: 0.8mm; REACH SVHC: No SVHC; Lead Free: Lead Free; RoHS Compliant: Yes; ComponentLink1URL: https://datasheet.ciiva.com/11808/0900766b80f96399-11808742.pdf?src-supplier=RSComponents; ComponentLink1Description: https://datasheet.ciiva.com/11808/0900766b80f96399-11808742.pdf?src-supplier=RSComponents; ComponentLink2URL: https://datasheet.ciiva.com/46440/1868787-46440903.pdf?src-supplier=Element14; ComponentLink2Description: https://datasheet.ciiva.com/46440/1868787-46440903.pdf?src-supplier=Element14; ComponentLink3URL: https://datasheet.ciiva.com/12558/rc0603-272842-12558598.pdf?src-supplier=Mouser; ComponentLink3Description: https://datasheet.ciiva.com/12558/rc0603-272842-12558598.pdf?src-supplier=Mouser; ComponentLink4URL: https://datasheet.ciiva.com/7746/443971-7746319.pdf?src-supplier=Element14; ComponentLink4Description: https://datasheet.ciiva.com/7746/443971-7746319.pdf?src-supplier=Element14; Supplier Part Number 1: YAG3329CT-ND
R5 = RC0603FR-074M7L: RES 4.7M OHM 1% 1/10W 0603; Manufacturer: Yageo; Temperature Coefficient: 100ppm/°C; Power Rating: 100mW; Voltage Rating: 50V; Supplier 1: Digi-Key; Manufacturer Part Number: RC0603FR-074M7L; RoHS: Yes; Category: Chip SMD Resistors; Stock 1: 424983; Pricing 1: 1=0.10000, 10=0.02400, 100=0.00970, 1000=0.00436, 2500=0.00378 (USD); Case/Package: 0603; Number of Pins: 2; Case Code (Imperial): 0603; Case Code (Metric): 1608; Size Code: 0603; Min Operating Temperature: -55°C; Max Operating Temperature: 155°C; Tolerance: 1%; Packaging: Tape and Reel; Voltage Rating (DC): 50V; Termination: SMD/SMT; Resistor Type: Thick Film; Features: Moisture Resistant; Series: RC; Max Power Dissipation: 100mW; Number of Terminations: 2; Resistance Tolerance: 1%; Technology: THICK FILM; Construction: Rectangular; Length: 1.6mm; Width: 0.8mm; Height: 0.45mm; Depth: 0.8mm; RoHS Compliant: Yes; REACH SVHC: No SVHC; Military Standard: Not; Lead Free: Lead Free; ComponentLink1URL: https://datasheet.ciiva.com/11819/0900766b80f96399-11819362.pdf?src-supplier=RSComponents; ComponentLink1Description: https://datasheet.ciiva.com/11819/0900766b80f96399-11819362.pdf?src-supplier=RSComponents; ComponentLink2URL: https://datasheet.ciiva.com/7746/443971-7746367.pdf?src-supplier=Element14; ComponentLink2Description: https://datasheet.ciiva.com/7746/443971-7746367.pdf?src-supplier=Element14; ComponentLink3URL: https://datasheet.ciiva.com/15189/getdatasheetpartid-328863-15189765.pdf?src-supplier=Verical; ComponentLink3Description: https://datasheet.ciiva.com/15189/getdatasheetpartid-328863-15189765.pdf?src-supplier=Verical; Supplier Part Number 1: 311-4.70MHRCT-ND
R10 R11 = RMCF0603FT5K10: Res Thick Film 0603 5.1K Ohm 1% 0.1W(1/10W) ±100ppm/C Pad SMD Automotive T/R; Manufacturer: Stackpole Electronics; Max Power Dissipation: 100mW; Temperature Coefficient: 100ppm/°C; Supplier 1: Digi-Key; Manufacturer Part Number: RMCF0603FT5K10; RoHS: Yes; Category: Chip SMD Resistors; Stock 1: 1237364; Pricing 1: 1=0.10000, 10=0.01700, 100=0.00680, 1000=0.00305, 2500=0.00264 (USD); Mount: Surface Mount; Case/Package: 0603; Case Code (Metric): 1608; Case Code (Imperial): 0603; Contact Plating: Tin,Matte; Min Operating Temperature: -55°C; Max Operating Temperature: 155°C; Tolerance: 1%; Packaging: Tape and Reel; Resistor Type: Thick Film; Number of Terminations: 2; Features: Automotive AEC-Q200; Series: RMCF; Length: 0.061inch; Width: 0.031inch; Height: 0.022inch; Radiation Hardening: No; RoHS Compliant: Yes; ComponentLink1URL: http://components.arrow.com/part/dataview/50863347S9465827N1174?src-supplier=Arrow+Electronics; ComponentLink1Description: http://components.arrow.com/part/dataview/50863347S9465827N1174?src-supplier=Arrow+Electronics; ComponentLink2URL: https://www.seielect.com/catalog/SEI-RMCF_RMCP.pdf?src-supplier=Avnet; ComponentLink2Description: https://www.seielect.com/catalog/SEI-RMCF_RMCP.pdf?src-supplier=Avnet; ComponentLink3URL: https://www.seielect.com/catalog/SEI-Packaging.pdf?src-supplier=Digi-Key; ComponentLink3Description: https://www.seielect.com/catalog/SEI-Packaging.pdf?src-supplier=Digi-Key; Supplier Part Number 1: RMCF0603FT5K10CT-ND
S3 S4 = TL3330AF130QG: Switch Tactile N.O. SPST Rectangular Button Gull Wing 0.05A 12VDC 50000Cycles 1.27N SMD T/R; Manufacturer: E-Switch; Actuator Material: Nylon,Polyamide; Operating Force: 130gf; Illumination Type: Non-Illuminated,Illuminated; Switch Travel: 0.25mm; Switch Function: Off-Mom; Voltage Rating (DC): 12V; Contact Resistance: 100mR; Current Rating: 50mA; Actuator Length: 1mm; Supplier 1: Digi-Key; RoHS: Yes; Category: Tactile Switches; Stock 1: 42241; Pricing 1: 1=0.51000, 10=0.48800, 25=0.47000, 100=0.40680, 250=0.37060, 500=0.34350, 1000=0.30734 (USD); Mount: Surface Mount; Case/Package: SMD/SMT; Contact Plating: Silver; Mechanical Life: 50000Cycles; Contact Material: Silver; Color: Black; Min Operating Temperature: -30°C; Max Operating Temperature: 70°C; Package Quantity: 1; Packaging: Tape and Reel; Throw Configuration: SPST; Termination: Gull Wing; Orientation: Right Angle; Series: TL3330; Max Voltage Rating (DC): 12V; Electrical Life: 50000Cycles; Size: 5.3mm; Lead Free: Lead Free; REACH SVHC: No SVHC; RoHS Compliant: Yes; ComponentLink1URL: https://datasheet.ciiva.com/2900/p010950-2900785.pdf?src-supplier=Digi-Key; ComponentLink1Description: https://datasheet.ciiva.com/2900/p010950-2900785.pdf?src-supplier=Digi-Key; ComponentLink2URL: https://datasheet.ciiva.com/23713/tl3330-23713381.pdf?src-supplier=Newark; ComponentLink2Description: https://datasheet.ciiva.com/23713/tl3330-23713381.pdf?src-supplier=Newark; ComponentLink3URL: https://datasheet.ciiva.com/2900/p010950-2900786.pdf?src-supplier=Digi-Key; ComponentLink3Description: https://datasheet.ciiva.com/2900/p010950-2900786.pdf?src-supplier=Digi-Key; ComponentLink4URL: https://datasheet.ciiva.com/2900/p010950-2900787.pdf?src-supplier=Digi-Key; ComponentLink4Description: https://datasheet.ciiva.com/2900/p010950-2900787.pdf?src-supplier=Digi-Key; Supplier Part Number 1: EG4388CT-ND; Manufacturer Part Number: TL3330AF130QG
U1 = GC9A01: GC9A01 LCD Display
U2 = ESP32-C3-MINI-1-H4: SMD Module, ESP32-C3FH4, Pcb Ant; Manufacturer: Espressif Systems; Supplier 1: Digi-Key; Manufacturer Part Number: ESP32-C3-MINI-1-H4; RoHS: No; Stock 1: 1970; Pricing 1: 1=1.95000 (USD); Supplier Part Number 1: 1965-ESP32-C3-MINI-1-H4CT-ND

## Sheet Sensors.SchDoc: Sensors
size 279 x 215 mm; Engineer: Jason Skells; SheetNumber: 3; SheetTotal: 4
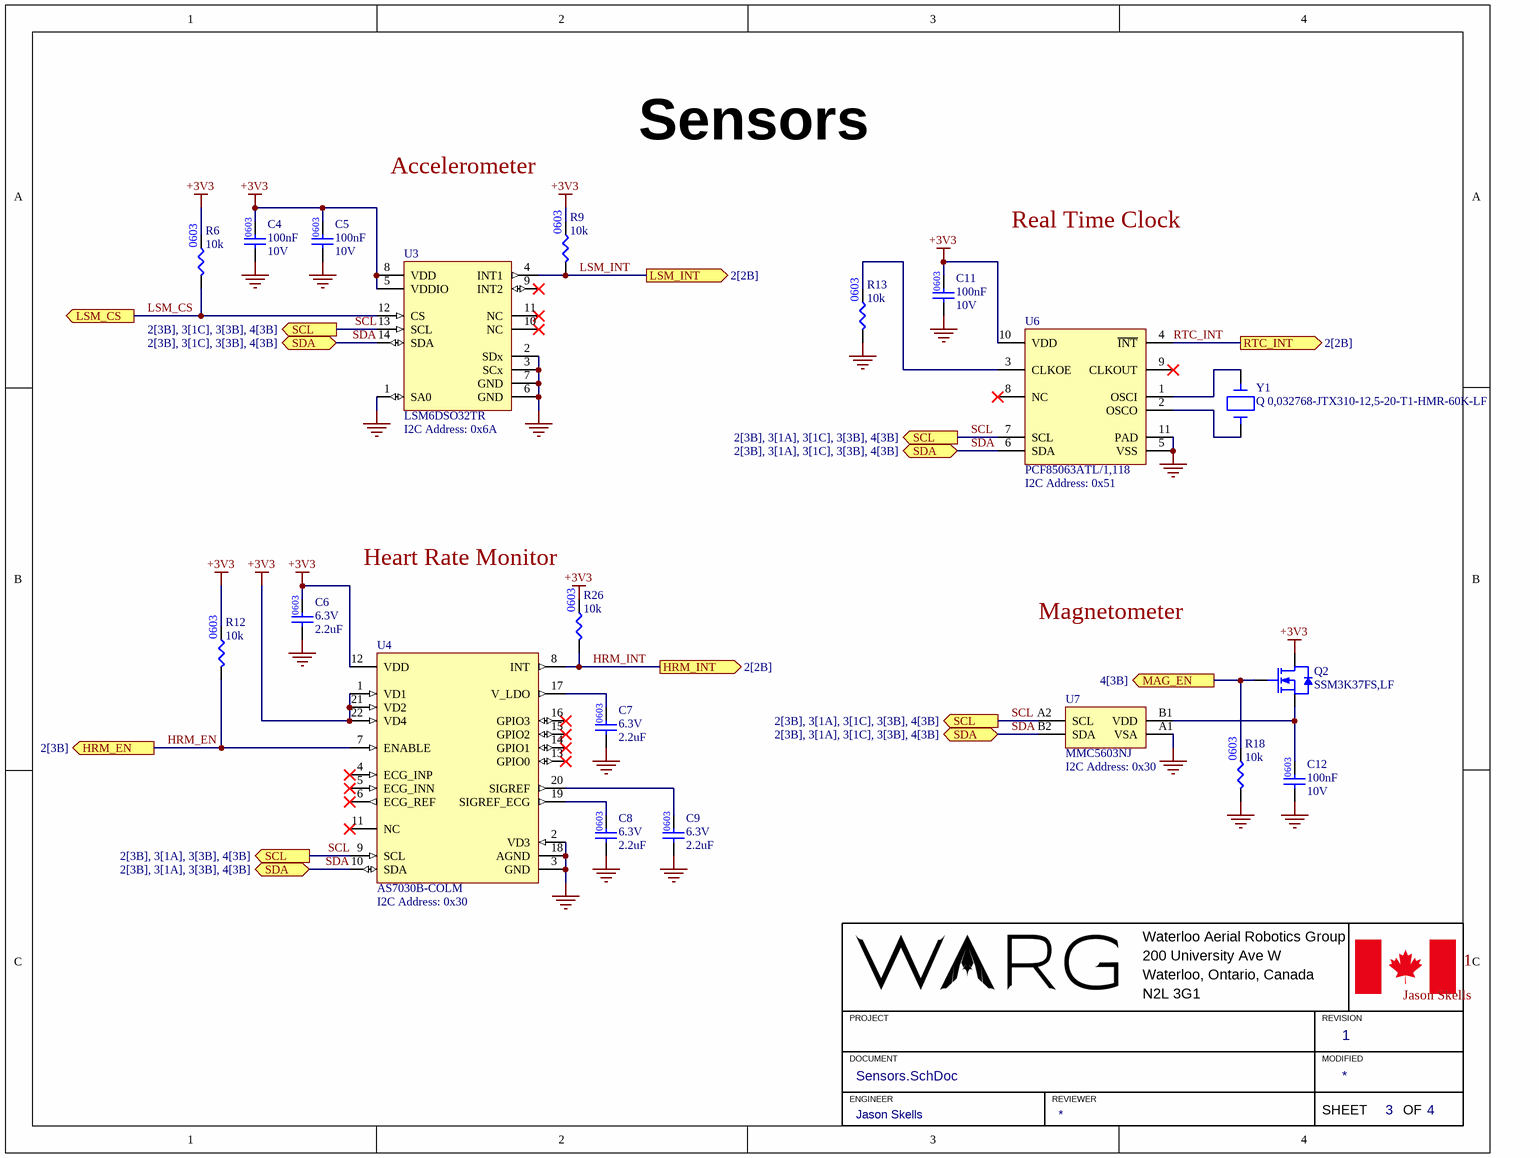
[diagram p2: Sensors.SchDoc]

### Parts
C4  Capacitance: 100nF  Voltage Rating: 10V  [CAP_0603]  (hidden comment: CC0603KRX7R6BB104)
C5  Capacitance: 100nF  Voltage Rating: 10V  [CAP_0603]  (hidden comment: CC0603KRX7R6BB104)
C6  Voltage Rating: 6.3V  Capacitance: 2.2uF  [CAP_0603]  (hidden comment: CL10A225KQ8NNNC)
C7  Voltage Rating: 6.3V  Capacitance: 2.2uF  [CAP_0603]  (hidden comment: CL10A225KQ8NNNC)
C8  Voltage Rating: 6.3V  Capacitance: 2.2uF  [CAP_0603]  (hidden comment: CL10A225KQ8NNNC)
C9  Voltage Rating: 6.3V  Capacitance: 2.2uF  [CAP_0603]  (hidden comment: CL10A225KQ8NNNC)
C11  Capacitance: 100nF  Voltage Rating: 10V  [CAP_0603]  (hidden comment: CC0603KRX7R6BB104)
C12  Capacitance: 100nF  Voltage Rating: 10V  [CAP_0603]  (hidden comment: CC0603KRX7R6BB104)
Q2  SSM3K37FS,LF  [SSM3K37FS,LF]
R6  Resistance: 10k  [RES_0603]  (hidden comment: RNCP0603FTD10K0)
R9  Resistance: 10k  [RES_0603]  (hidden comment: RNCP0603FTD10K0)
R12  Resistance: 10k  [RES_0603]  (hidden comment: RNCP0603FTD10K0)
R13  Resistance: 10k  [RES_0603]  (hidden comment: RNCP0603FTD10K0)
R18  Resistance: 10k  [RES_0603]  (hidden comment: RNCP0603FTD10K0)
R26  Resistance: 10k  [RES_0603]  (hidden comment: RNCP0603FTD10K0)
U3  LSM6DSO32TR  [LSM6DSO32]
U4  AS7030B-COLM  [AS7030B-COLM]
U6  PCF85063ATL/1,118  [PCF85063ATL/1,118]
U7  MMC5603NJ  [MMC5603NJ]
Y1  Q 0,032768-JTX310-12,5-20-T1-HMR-60K-LF  [Q 0,032768-JTX310-12,5-20-T1-HMR-60K-LF]

### Ports
HRM_EN (out, see 2[3B]), HRM_INT (out, see 2[2B]), LSM_CS (out), LSM_INT (out, see 2[2B]), MAG_EN (out, see 4[3B]), RTC_INT (out, see 2[2B]), SCL (out, see 2[3B], 3[1A], 3[1C], 3[3B], 4[3B]), SCL (out, see 2[3B], 3[1A], 3[3B], 4[3B]), SCL (out, see 2[3B], 3[1C], 3[3B], 4[3B]), SDA (bidir, see 2[3B], 3[1A], 3[1C], 3[3B], 4[3B]), SDA (bidir, see 2[3B], 3[1A], 3[3B], 4[3B]), SDA (bidir, see 2[3B], 3[1C], 3[3B], 4[3B])

### Nets
+3V3: C4.2 C5.2 C6.2 C11.2 Q2.1(Drain) R6.2 R9.2 R12.2 R26.2 U3.5(VDDIO) U3.8(VDD) U4.1(VD1) U4.12(VDD) U4.21(VD2) U4.22(VD4) U6.10(VDD)
GND: C4.1 C5.1 C6.1 C7.1 C8.1 C9.1 C11.1 C12.1 R13.1 R18.1 U3.1(SA0) U3.2(SDx) U3.3(SCx) U3.6(GND) U3.7(GND) U4.2(VD3) U4.3(GND) U4.18(AGND) U6.5(VSS) U6.11(PAD) U7.A1(VSA)
HRM_EN: R12.1 U4.7(ENABLE) ; port HRM_EN
HRM_INT: R26.1 U4.8(INT) ; port HRM_INT
LSM_CS: R6.1 U3.12(CS) ; port LSM_CS
LSM_INT: R9.1 U3.4(INT1) ; port LSM_INT
MAG_EN: Q2.2(Gate) R18.2 ; port MAG_EN
RTC_INT: U6.4(~{INT}) ; port RTC_INT
SCL: U3.13(SCL) U4.9(SCL) U6.7(SCL) U7.A2(SCL) ; port SCL
SDA: U3.14(SDA) U4.10(SDA) U6.6(SDA) U7.B2(SDA) ; port SDA
NetC7_2: C7.2 U4.17(V_LDO)
NetC8_2: C8.2 U4.19(SIGREF_ECG)
NetC9_2: C9.2 U4.20(SIGREF)
NetC12_2: C12.2 Q2.3(Source) U7.B1(VDD)
NetR13_2: R13.2 U6.3(CLKOE)
NetU6_1: U6.1(OSCI) Y1.1(In/Out)
NetU6_2: U6.2(OSCO) Y1.2(Out/In)

Not connected (* = marked no-connect by the designer): U3 9(INT2)* 10(NC)* 11(NC)*; U4 4(ECG_INP)* 5(ECG_INN)* 6(ECG_REF)* 11(NC)* 13(GPIO0)* 14(GPIO1)* 15(GPIO2)* 16(GPIO3)*; U6 8(NC)* 9(CLKOUT)*

### Notes on the sheet
- Accelerometer
- Real Time Clock
- (near U3) I2C Address: 0x6A
- (near U6) I2C Address: 0x51
- (near R26) Heart Rate Monitor
- Magnetometer
- (near U7) I2C Address: 0x30
- (near U4) I2C Address: 0x30
- Waterloo Aerial Robotics Group
- 200 University Ave W
- PROJECT
- Waterloo, Ontario, Canada
- N2L 3G1
- REVISION
- DOCUMENT
- ENGINEER
- REVIEWER
- MODIFIED
- SHEET
- OF

### Library data of the parts
C4 C5 C11 C12 = CC0603KRX7R6BB104: as C15 on sheet Board_Power; Supplier 1: Digi-Key; Manufacturer Part Number: CC0603KRX7R6BB104; RoHS: Yes; Category: Ceramic Capacitors; Stock 1: 135167; Pricing 1: 1=0.11000, 10=0.07700, 50=0.04340, 100=0.03600, 500=0.02522, 1000=0.02089 (USD); Mount: Surface Mount; Case/Package: 0603; Case Code (Imperial): 0603; Case Code (Metric): 1608; Weight: 7.1E-05oz; Min Operating Temperature: -55°C; Max Operating Temperature: 125°C; Dielectric: X7R; Voltage Rating (DC): 10V; Packaging: Tape and Reel; Termination: SMD/SMT; Resistor Type: Ceramic; Series: CC; Construction: Flat; Length: 1.6mm; Width: 0.8mm; Height: 0.8mm; Thickness: 0.035inch; Depth: 0.8mm; Radiation Hardening: No; Lead Free: Lead Free; Halogen Free: Halogen Free; RoHS Compliant: Yes; ComponentLink1URL: https://datasheet.ciiva.com/11586/upy-gphc-x7r-6-3v-to-50v-8-11586327.pdf?src-supplier=Avnet; ComponentLink1Description: https://datasheet.ciiva.com/11586/upy-gphc-x7r-6-3v-to-50v-8-11586327.pdf?src-supplier=Avnet; Supplier Part Number 1: 311-4055-1-ND
C6-C9 = CL10A225KQ8NNNC: as C17 on sheet Board_Power; Supplier 1: Digi-Key; Manufacturer Part Number: CL10A225KQ8NNNC; RoHS: Yes; Category: Ceramic Capacitors; Stock 1: 697049; Pricing 1: 1=0.10000, 10=0.04200, 50=0.02300, 100=0.01870, 500=0.01336, 1000=0.01050 (USD); Mount: Surface Mount; Case/Package: 0603; Case Code (Metric): 1608; Case Code (Imperial): 0603; Contact Plating: Tin; Min Operating Temperature: -55°C; Max Operating Temperature: 85°C; Packaging: Tape and Reel; Package Quantity: 1; Dielectric: X5R; Voltage Rating (DC): 6.3V; Series: CL; Construction: Flat; Voltage: 6.3V; Length: 1.6mm; Width: 0.031inch; Height: 0.8mm; Thickness: 0.035inch; Depth: 0.8mm; Radiation Hardening: No; Lead Free: Lead Free; RoHS Compliant: Yes; ComponentLink1URL: https://datasheet.ciiva.com/16199/cl10a225kq8nnnc-16199203.pdf?src-supplier=Future+Electronics; ComponentLink1Description: https://datasheet.ciiva.com/16199/cl10a225kq8nnnc-16199203.pdf?src-supplier=Future+Electronics; ComponentLink2URL: https://datasheet.ciiva.com/15195/getdatasheetpartid-358618-15195712.pdf?src-supplier=Verical; ComponentLink2Description: https://datasheet.ciiva.com/15195/getdatasheetpartid-358618-15195712.pdf?src-supplier=Verical; Supplier Part Number 1: 1276-1183-1-ND
Q2 = SSM3K37FS,LF: as Q1 on sheet ESP32; Supplier 1: Digi-Key; RoHS: Yes; Category: MOSFETs; Stock 1: 73760; Pricing 1: 1=0.25000, 10=0.20100, 100=0.10660, 500=0.07012, 1000=0.04768 (USD); Mount: Surface Mount; Packaging: Tape and Reel; Drain to Source Voltage (Vdss): 20V; Continuous Drain Current (ID): 200mA; ComponentLink1URL: https://toshiba.semicon-storage.com/info/docget.jsp?did=6172&prodName=SSM3K37FS&src-supplier=Digi-Key; ComponentLink1Description: https://toshiba.semicon-storage.com/info/docget.jsp?did=6172&prodName=SSM3K37FS&src-supplier=Digi-Key; Supplier Part Number 1: SSM3K37FSLFCT-ND; Manufacturer Part Number: SSM3K37FS,LF
R6 R9 R12 R13 R18 R26 = RNCP0603FTD10K0: as R21 on sheet Board_Power; Supplier 1: Digi-Key; Manufacturer Part Number: RNCP0603FTD10K0; RoHS: Yes; Category: Chip SMD Resistors; Stock 1: 2737524; Pricing 1: 1=0.10000, 10=0.06100, 100=0.02480, 1000=0.01113, 2500=0.00966 (USD); Mount: Surface Mount; Case/Package: 0603; Case Code (Metric): 1608; Case Code (Imperial): 0603; Contact Plating: Tin,Matte; Min Operating Temperature: -55°C; Max Operating Temperature: 155°C; Packaging: Tape and Reel; Tolerance: 1%; Resistor Type: Thin Film; Number of Terminations: 2; Temperature Coefficient: 100ppm/°C; Features: Moisture Resistant,Anti-Sulfur; Series: RNCP; Length: 0.059inch; Width: 0.031inch; Height: 0.02inch; Radiation Hardening: No; Lead Free: Lead Free; RoHS Compliant: Yes; ComponentLink1URL: https://www.seielect.com/Catalog/SEI-rncp.pdf?src-supplier=Avnet; ComponentLink1Description: https://www.seielect.com/Catalog/SEI-rncp.pdf?src-supplier=Avnet; ComponentLink2URL: https://www.seielect.com/Catalog/SEI-rncp.pdf?src-supplier=Digi-Key; ComponentLink2Description: https://www.seielect.com/Catalog/SEI-rncp.pdf?src-supplier=Digi-Key; ComponentLink3URL: https://www.seielect.com/catalog/SEI-Packaging.pdf?src-supplier=Digi-Key; ComponentLink3Description: https://www.seielect.com/catalog/SEI-Packaging.pdf?src-supplier=Digi-Key; Supplier Part Number 1: RNCP0603FTD10K0CT-ND
U3 = LSM6DSO32TR: Accelerometer and 3D Gyroscope 3D Always-On 1.71V to 3.6V 0.55mA 14-Pin LGA T/R; Manufacturer: STMicroelectronics; Supplier 1: Digi-Key; Manufacturer Part Number: LSM6DSO32TR; RoHS: Yes; Category: Inertial Measurement Units (IMUs); Stock 1: 3146; Pricing 1: 1=5.47000, 10=4.91400, 25=4.64520, 100=4.02600, 500=3.44102 (USD); Supplier Part Number 1: 497-LSM6DSO32CT-ND
U4 = AS7030B-COLM: AS703x Series 5.5 V Medical or Consumer Grade Vital Sign Sensor Module - OLGA-22; Manufacturer: ams; Supplier 1: Mouser; Manufacturer Part Number: AS7030B-COLM; RoHS: No; Supplier Part Number 1: 985-AS7030B-COLM
U6 = PCF85063ATL/1,118: IC RTC CLK/CALENDAR I2C 10-SON; Manufacturer: NXP Semiconductors; Max Supply Voltage: 5.5V; Min Supply Voltage: 900mV; Logic Function: Clock; Date Format: Binary; Time Format: HH:MM:SS; Supplier 1: Digi-Key; Manufacturer Part Number: PCF85063ATL/1,118; RoHS: Yes; Category: Real Time Clocks; Stock 1: 59710; Pricing 1: 1=0.99000, 10=0.88300, 25=0.83840, 100=0.81280 (USD); Mount: Surface Mount; Case/Package: DFN EP; Number of Pins: 10; Min Operating Temperature: -40°C; Max Operating Temperature: 85°C; Packaging: Tape and Reel; Package Quantity: 4000; Interface: I2C; Radiation Hardening: No; REACH SVHC: No SVHC; Lead Free: Lead Free; RoHS Compliant: Yes; ComponentLink1URL: https://datasheet.ciiva.com/24009/pcf85063atl-260519-24009961.pdf?src-supplier=Mouser; ComponentLink1Description: https://datasheet.ciiva.com/24009/pcf85063atl-260519-24009961.pdf?src-supplier=Mouser; ComponentLink2URL: https://datasheet.ciiva.com/29888/pcf85063a-29888091.pdf?src-supplier=Avnet; ComponentLink2Description: https://datasheet.ciiva.com/29888/pcf85063a-29888091.pdf?src-supplier=Avnet; Supplier Part Number 1: 568-10235-1-ND
U7 = MMC5603NJ: 3-AXIS Amr Magnetic Sensor; Manufacturer: Memsic; Supplier 1: Digi-Key; RoHS: Yes; Stock 1: 55171; Pricing 1: 1=1.12000, 5=1.06600, 10=0.92800, 25=0.81520, 50=0.67720, 100=0.57680, 500=0.50160, 1000=0.43890, 5000=0.38874 (USD); Supplier Part Number 1: 1267-MMC5603NJCT-ND; Manufacturer Part Number: MMC5603NJ
Y1 = Q 0,032768-JTX310-12,5-20-T1-HMR-60K-LF: Crystal 32.7680KHZ 12.5PF SMD; Manufacturer: Jauch; ESR: 60k; Supplier 1: Digi-Key; RoHS: No; Stock 1: 4280; Pricing 1: 1=0.59000, 10=0.49500, 50=0.44560, 100=0.39600, 500=0.37620, 1000=0.31680 (USD); Supplier Part Number 1: 1908-1315-1-ND; Load Capacitance: 12.5pF; Manufacturer Part Number: Q 0,032768-JTX310-12,5-20-T1-HMR-60K-LF